# EAGLE design X16-ESC-Adapter (EAGLE 9.6.2)
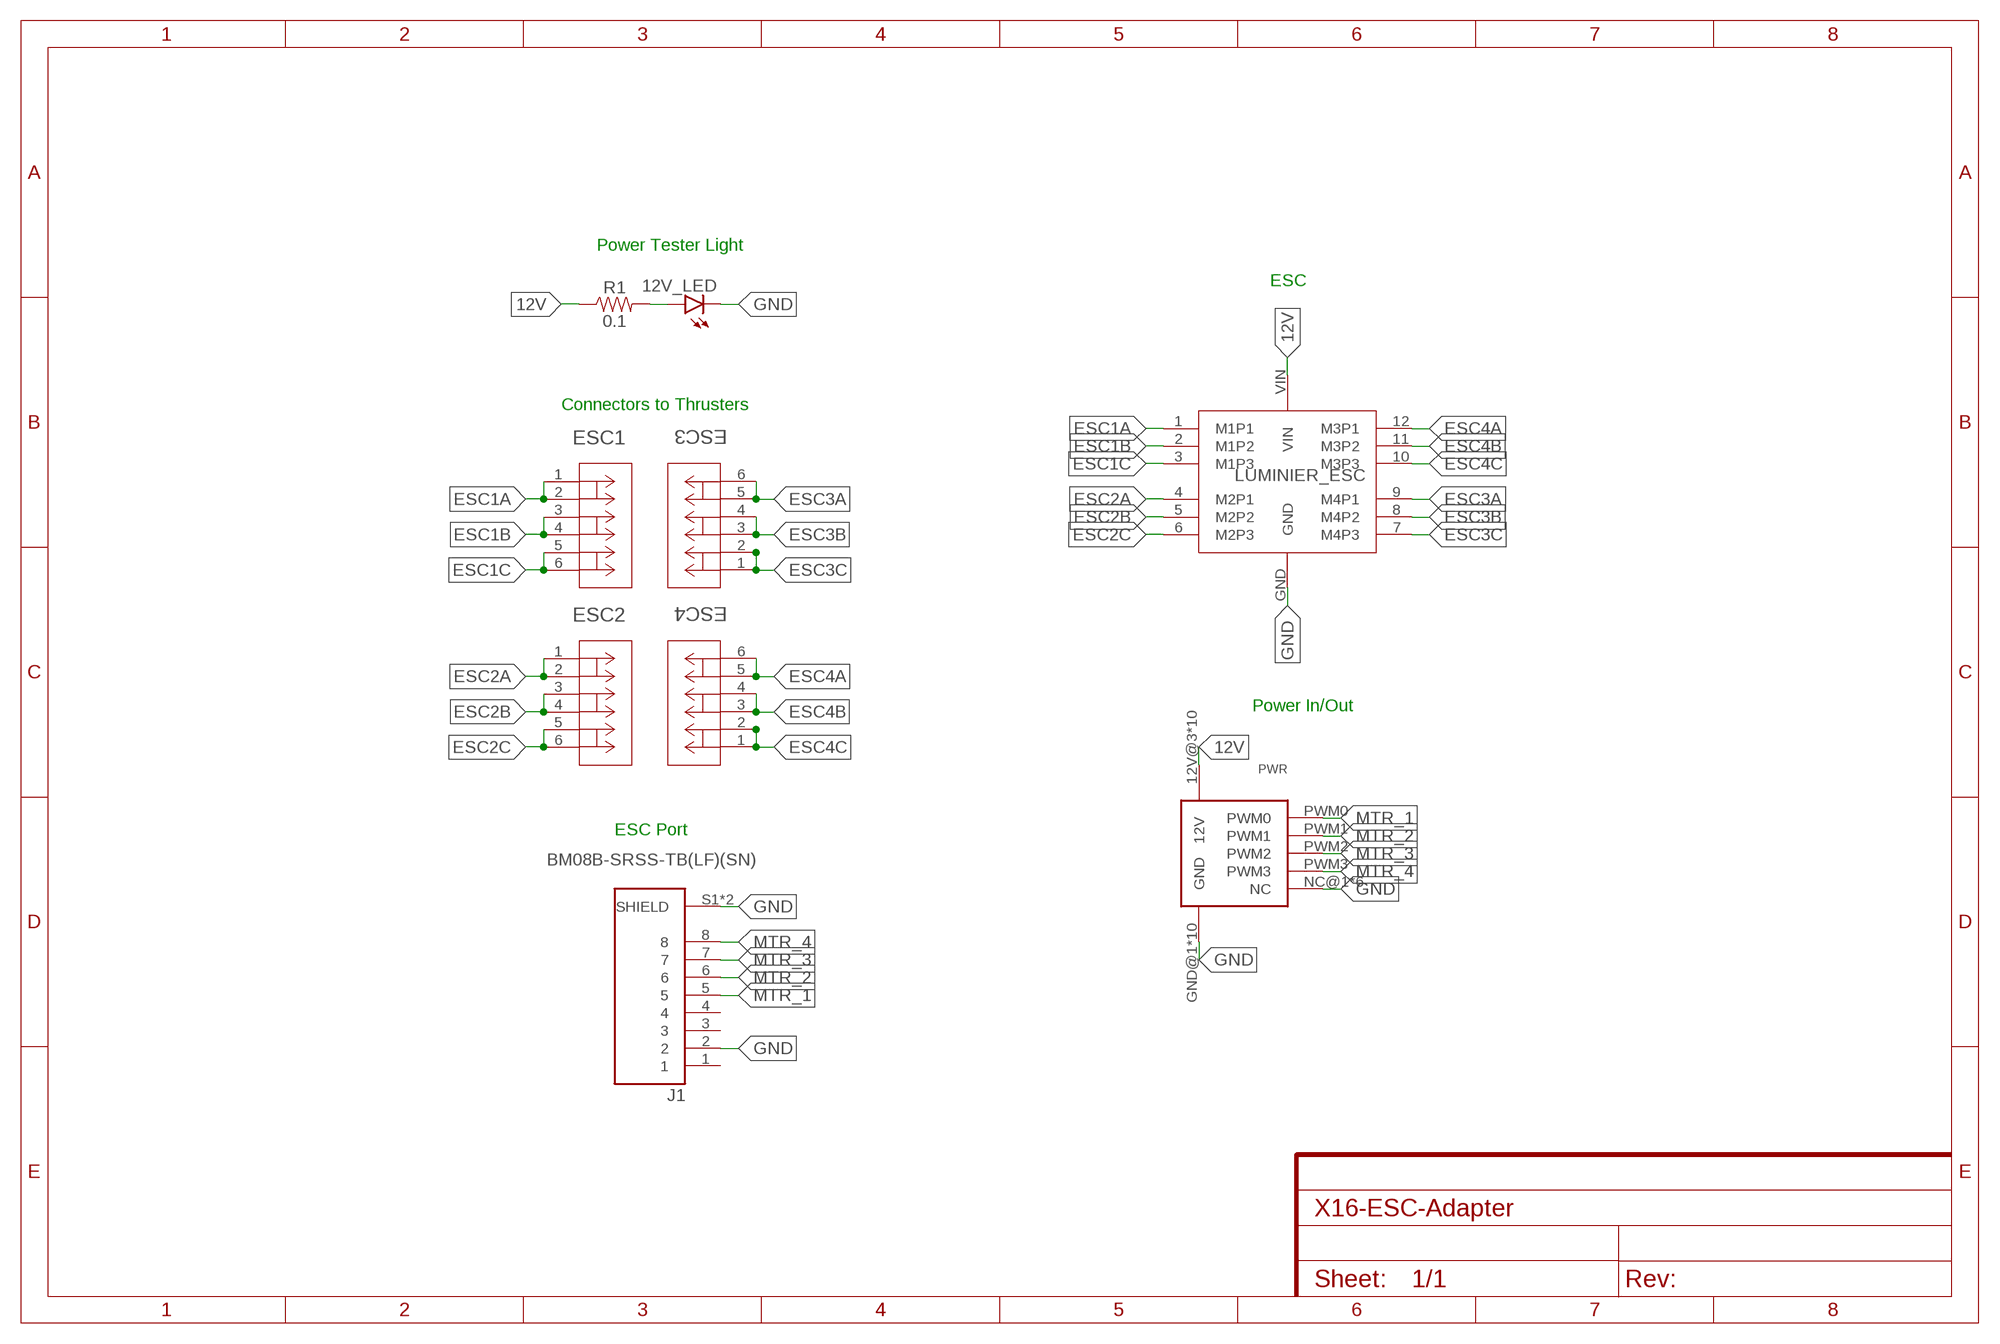
[diagram p0: schematic, sheet 1]

## Parts
12V_LED  LEDCHIPLED_0805  [CHIPLED_0805]
ESC1  CONN_1824750000  [CONN3_1824750000_WED]
ESC2  CONN_1824750000  [CONN3_1824750000_WED]
ESC3  CONN_1824750000  [CONN3_1824750000_WED]
ESC4  CONN_1824750000  [CONN3_1824750000_WED]
J1  BM08B-SRSS-TB(LF)(SN)  [JST_BM08B-SRSS-TB(LF)(SN)]
LUMINIER_ESC  LUMENIER  [LUMENIER]
PWR  CONN_BACKPLANE_ESC_ADAPTER  [CONN_BACKPLANE_ESC_ADAPTER]
R1  0.1  0.1OHM-0603-1/3W-1%  [0603]

## Nets
12V: LUMINIER_ESC.VIN PWR.12V@3(12V) PWR.12V@4(12V) PWR.12V@5(12V) PWR.12V@6(12V) PWR.12V@7(12V) PWR.12V@8(12V) PWR.12V@9(12V) PWR.12V@10(12V) PWR.12V@11(12V) PWR.12V@12(12V) R1.1
ESC1A: ESC1.1 ESC1.2 LUMINIER_ESC.1(M1P1)
ESC1B: ESC1.3 ESC1.4 LUMINIER_ESC.2(M1P2)
ESC1C: ESC1.5 ESC1.6 LUMINIER_ESC.3(M1P3)
ESC2A: ESC2.1 ESC2.2 LUMINIER_ESC.4(M2P1)
ESC2B: ESC2.3 ESC2.4 LUMINIER_ESC.5(M2P2)
ESC2C: ESC2.5 ESC2.6 LUMINIER_ESC.6(M2P3)
ESC3A: ESC3.5 ESC3.6 LUMINIER_ESC.9(M4P1)
ESC3B: ESC3.3 ESC3.4 LUMINIER_ESC.8(M4P2)
ESC3C: ESC3.1 ESC3.2 LUMINIER_ESC.7(M4P3)
ESC4A: ESC4.5 ESC4.6 LUMINIER_ESC.12(M3P1)
ESC4B: ESC4.3 ESC4.4 LUMINIER_ESC.11(M3P2)
ESC4C: ESC4.1 ESC4.2 LUMINIER_ESC.10(M3P3)
GND: 12V_LED.C J1.2 J1.S1(SHIELD) J1.S2(SHIELD) LUMINIER_ESC.GND PWR.GND@1(GND) PWR.GND@2(GND) PWR.GND@3(GND) PWR.GND@4(GND) PWR.GND@5(GND) PWR.GND@6(GND) PWR.GND@7(GND) PWR.GND@8(GND) PWR.GND@9(GND) PWR.GND@10(GND) PWR.NC@1(NC) PWR.NC@2(NC) PWR.NC@3(NC) PWR.NC@4(NC) PWR.NC@5(NC) PWR.NC@6(NC)
MTR_1: J1.5 PWR.PWM0
MTR_2: J1.6 PWR.PWM1
MTR_3: J1.7 PWR.PWM2
MTR_4: J1.8 PWR.PWM3
N$1: 12V_LED.A R1.2
Unconnected: J1.1 J1.3 J1.4

## Notes on the sheet
- Power Tester Light
- ESC
- Connectors to Thrusters
- Power In/Out
- ESC Port

## Library data of the parts
12V_LED = led:LED: LED OSRAM: - CHIPLED LG R971, LG N971, LY N971, LG Q971, LY Q971, LO R971, LY R971 LH N974, LH R974 LS Q976, LO Q976, LY Q976 LO Q996 - Hyper CHIPLED LW Q18S LB Q993, LB Q99A, LB R99A - SideLED LS A670, LO A670, LY A670, LG A670, LP A670 LB A673, LV A673, LT A673, LW A673 LH A674 LY A675 LS A676, LA A676, LO A676, LY A676, LW A676 LS A679, LY A679, LG A679 - Hyper Micro SIDELED® LS Y876, LA Y876, LO Y876, LY Y876 LT Y87S - SmartLED LW L88C, LW L88S LB L89C, LB L89S, LG L890 LS L89K, LO L89K, LY L89K LS L896, LA L896, LO L896, LY L896 - TOPLED LS T670, LO T670, LY T670, LG T670, LP T670 LSG T670, LSP T670, LSY T670, LOP T670, LYG T670 LG T671, LOG T671, LSG T671 LB T673, LV T673, LT T673, LW T673 LH T674 LS T676, LA T676, LO T676, LY T676, LB T676, LH T676, LSB T676, LW T676 LB T67C, LV T67C, LT T67C, LS T67K, LO T67K, LY T67K, LW E67C LS E67B, LA E67B, LO E67B, LY E67B, LB E67C, LV E67C, LT E67C LW T67C LS T679, LY T679, LG T679 LS T770, LO T770, LY T770, LG T770, LP T770 LB T773, LV T773, LT T773, LW T773 LH T774 LS E675, LA E675, LY E675, LS T675 LS T776, LA T776, LO T776, LY T776, LB T776 LHGB T686 LT T68C, LB T68C - Hyper Mini TOPLED® LB M676 - Mini TOPLED Santana® LG M470 LS M47K, LO M47K, LY M47K Source: http://www.osram.convergy.de LUXEON: - LUMILED® LXK2-PW12-R00, LXK2-PW12-S00, LXK2-PW14-U00, LXK2-PW14-V00 LXK2-PM12-R00, LXK2-PM12-S00, LXK2-PM14-U00 LXK2-PE12-Q00, LXK2-PE12-R00, LXK2-PE12-S00, LXK2-PE14-T00, LXK2-PE14-U00 LXK2-PB12-K00, LXK2-PB12-L00, LXK2-PB12-M00, LXK2-PB14-N00, LXK2-PB14-P00, LXK2-PB14-Q00 LXK2-PR12-L00, LXK2-PR12-M00, LXK2-PR14-Q00, LXK2-PR14-R00 LXK2-PD12-Q00, LXK2-PD12-R00, LXK2-PD12-S00 LXK2-PH12-R00, LXK2-PH12-S00 LXK2-PL12-P00, LXK2-PL12-Q00, LXK2-PL12-R00 Source: www.luxeon.com KINGBRIGHT: KA-3528ASYC Source: www.kingbright.com
ESC1-ESC4 = X16-ESC-Adapter:CONN_1824750000: ESC Adapter to Thruster; COPYRIGHT: Copyright (C) 2023 Ultra Librarian. All rights reserved.; DIGIKEY_PART_NUMBER_1: 281-2111-ND; MANUFACTURER_PART_NUMBER: 1824750000; MFR_NAME: Weidmuller
J1 = X16-ESC-Adapter:BM08B-SRSS-TB(LF)(SN); MANUFACTURER: JST Sales America Inc.; MAXIMUM_PACKAGE_HEIGHT: 6.3 mm; PARTREV: N/A; SNAPEDA_PN: BM08B-SRSS-TB(LF)(SN); STANDARD: Manufacturer Recommendations
LUMINIER_ESC = X16-ESC-Adapter:LUMENIER
PWR = X16-NewESCAdapterConn:CONN_BACKPLANE_ESC_ADAPTER: ESC Adapter to Backplane
R1 = SparkFun-Resistors:0.1OHM: 0.1Ω resistor A resistor is a passive two-terminal electrical component that implements electrical resistance as a circuit element. Resistors act to reduce current flow, and, at the same time, act to lower voltage levels within circuits. - Wikipedia; PROD_ID: RES-15715

## Board
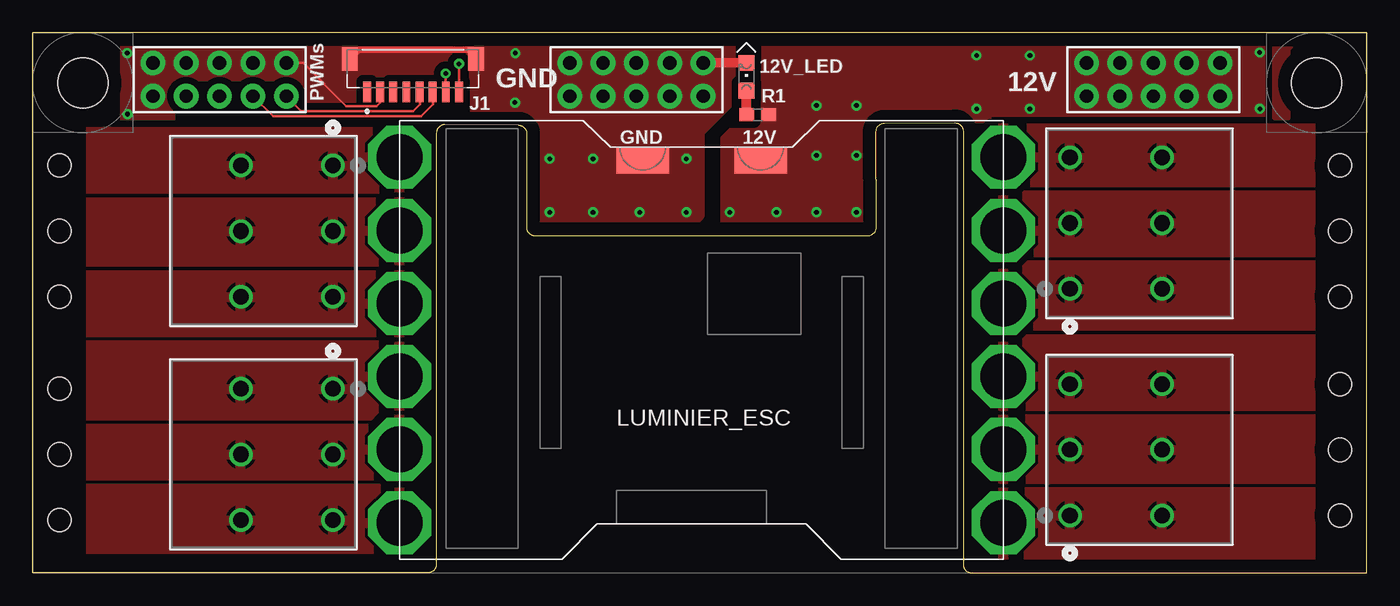
[diagram p1: board, top side]
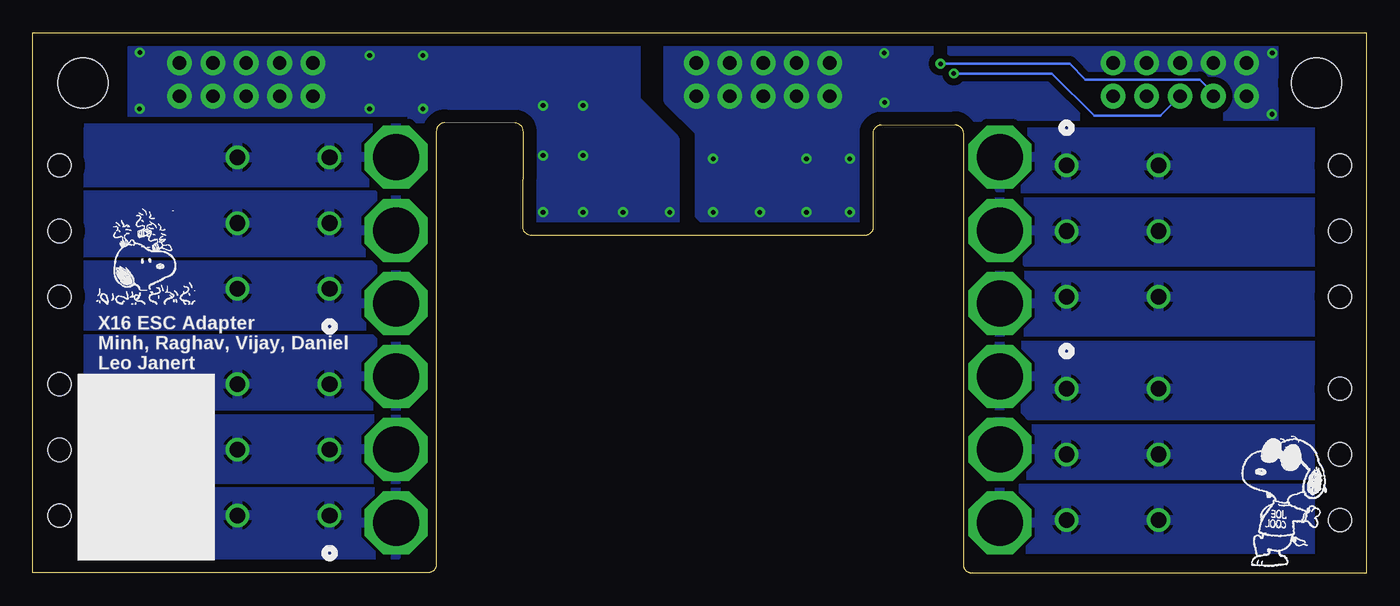
[diagram p2: board, bottom side, seen from below]

Size 101.6 x 41.15 mm. Coordinates in mm from the lower left corner, seen from the top.
Outline: 30.73,33.51 30.73,0.64 arc-90 30.1,0 0,0 0,41.15 101.6,41.15 101.6,0 71.5,0 arc-90 70.87,0.64 70.87,33.66 arc90 70.23,34.29 64.87,34.27 arc90 64.24,33.63 64.26,26.34 arc-90 63.62,25.7 38.23,25.7 arc-90 37.59,26.34 37.62,33.27 37.62,33.48 arc90 36.99,34.11 31.37,34.14 arc90 30.73,33.51
Copper layers (1*16): Top 0.035mm / dielectric 1.5mm / Bottom 0.035mm
Design rules "477": minimum track width 6mil, minimum drill 0.35mm, track to track 6mil, track to pad 6mil, pad to pad 6mil, via to via 6mil, smd to smd 6mil, copper to edge 40mil, drill to drill 6mil, minimum pad ring 10mil, minimum via ring 8mil, stop-mask expansion 4mil, vias tented up to drill 0mil, thermal gap 10mil
Holes 1.78 mm at 2.03,31.04 2.03,26.04 2.03,21.04 2.03,14.02 2.03,9.02 2.03,4.02 99.57,31.04 99.57,26.04 99.57,21.04 99.57,14.37 99.57,9.37 99.57,4.37

### Footprints (pad centres in the part's own frame; a part is rotated, then mirrored left to right if it is on the bottom)
CHIPLED_0805 = smd 1.2 x 1.2: A 0,-1.05; C 0,1.05
CONN3_1824750000_WED = drill 1.194 pad 1.702: 1 0,0; 2 0,-7.01; 3 5.004,0; 4 5.004,-7.01; 5 10.008,0; 6 10.008,-7.01
JST_BM08B-SRSS-TB(LF)(SN) = smd 0.6 x 1.55: 1 -3.5,-2.525; 2 -2.5,-2.525; 3 -1.5,-2.525; 4 -0.5,-2.525; 5 0.5,-2.525; 6 1.5,-2.525; 7 2.5,-2.525; 8 3.5,-2.525 | smd 1.2 x 1.8: S1 -4.8,0; S2 4.8,0
LUMENIER = drill 3.5 pad 4.8 octagon: 1 0,30.62; 2 0,25.05; 3 0,19.48; 4 0,13.92; 5 0,8.35; 6 0,2.78; 7 46,2.78; 8 46,8.35; 9 46,13.92; 10 46,19.48; 11 46,25.05; 12 46,30.62 | smd 4 x 2: GND 18.51,30.37; VIN 27.49,30.37
CONN_BACKPLANE_ESC_ADAPTER = drill 1.016 pad 1.88: 12V@3 90.424,36.322; 12V@4 90.424,38.862; 12V@5 87.884,36.322; 12V@6 87.884,38.862; 12V@7 85.344,36.322; 12V@8 85.344,38.862; 12V@9 82.804,36.322; 12V@10 82.804,38.862; 12V@11 80.264,36.322; 12V@12 80.264,38.862; GND@1 51.054,38.862; GND@2 51.054,36.322; GND@3 48.514,38.862; GND@4 48.514,36.322; GND@5 45.974,38.862; GND@6 45.974,36.322; GND@7 43.434,38.862; GND@8 43.434,36.322; GND@9 40.894,38.862; GND@10 40.894,36.322; NC@1 19.304,38.862; NC@2 16.764,38.862; NC@3 14.224,38.862; NC@4 11.684,38.862; NC@5 9.144,38.862; NC@6 9.144,36.322; PWM0 19.304,36.322; PWM1 16.764,36.322; PWM2 14.224,36.322; PWM3 11.684,36.322
0603 = smd 1.1 x 1: 1 -0.85,0; 2 0.85,0
6-32-HOLE = hole 3.81: 0,0

### Placement (x,y rotation side)
12V_LED  54.36,37.8 0 top
ESC1  22.86,31.04 270 top
ESC2  22.86,14.02 270 top
ESC3  78.99,4.37 90 top
ESC4  78.99,21.64 90 top
J1  28.96,39.17 0 top
LUMINIER_ESC  27.94,1.04 0 top
PWR  0,0 0 top
R1  55.22,34.9 180 top
U$1  [6-32-HOLE]  3.81,37.34 0 top
U$2  [6-32-HOLE]  97.79,37.34 0 top

### Tracks (layer width: path | path; a pad name or v marks a point on that pad's centre or on a via)
12V  (via drill 0.35)
  other vias: 53.09,27.48 56.64,27.48 59.69,27.48 62.74,27.48 62.74,31.8 62.74,35.61 59.69,35.61 59.69,31.8 71.88,35.36 71.88,39.42 75.95,39.42 75.95,35.36 93.45,39.65 93.47,35.36
  pour Top (isolate 0.508, rank 6, no thermals): 55.73,36.04 52.73,33.05 52.73,25.48 101.63,25.48 102.62,26.47 102.62,41.2 101.85,41.96 55.73,41.96
  pour Bottom (isolate 0.508, rank 6, no thermals): 55.7,36.04 52.73,33.07 52.73,25.5 101.9,25.5 102.62,26.21 102.62,41.2 101.85,41.96 55.7,41.96
  cutout Top: 97.79,34.01 101.57,34.01 101.57,-0.03 97.79,-0.03
ESC1A
  pour Top (isolate 0.508): 1.52,29.26 28.45,29.26 29.21,30.02 29.21,33.58 1.52,33.58
  pour Bottom (isolate 0.508): 1.52,33.58 1.52,29.26 27.94,29.26 29.72,31.04 29.72,32.82 28.96,33.58
ESC1B
  pour Top (isolate 0.508): 1.52,28.24 30.23,28.24 30.23,24.18 29.72,23.67 1.52,23.67
  pour Bottom (isolate 0.508): 28.96,28.24 1.52,28.24 1.52,23.67 25.91,23.67 26.42,24.18 28.96,24.18 29.97,25.2 29.97,27.23
ESC1C
  pour Top (isolate 0.508): 1.52,22.66 1.52,18.34 28.96,18.34 30.23,19.61 30.23,21.39 29.97,21.64 29.97,22.66
  pour Bottom (isolate 0.508): 28.96,22.66 1.52,22.66 1.52,18.34 28.7,18.34 29.97,19.61 29.97,21.64
ESC2A
  pour Top (isolate 0.508): 28.7,17.32 1.52,17.32 1.52,11.99 25.65,11.99 26.42,12.75 28.19,12.75 29.72,14.27 29.72,16.31
  pour Bottom (isolate 0.508): 28.7,17.32 1.52,17.32 1.52,11.99 25.65,11.99 26.42,12.75 28.7,12.75 29.97,14.02 29.97,16.05
ESC2B
  pour Top (isolate 0.508): 1.52,10.97 1.52,7.42 28.7,7.42 29.97,8.69 29.97,10.72 28.96,11.73 27.18,11.73 26.42,10.97
  pour Bottom (isolate 0.508): 26.42,10.97 1.52,10.97 1.52,7.42 28.7,7.42 29.97,8.69 29.97,10.46 28.96,11.48 26.92,11.48
ESC2C
  pour Top (isolate 0.508): 1.52,6.4 1.52,1.83 28.7,1.83 29.97,3.1 29.97,4.88 28.45,6.4
  pour Bottom (isolate 0.508): 1.52,6.4 28.7,6.4 29.97,5.13 29.97,3.35 28.45,1.83 1.52,1.83
ESC3A
  pour Top (isolate 0.508): 72.14,16.56 72.14,14.27 73.71,12.7 100.08,12.7 100.08,17.78 73.36,17.78
  pour Bottom (isolate 0.508): 73.41,17.78 100.08,17.78 100.08,12.75 73.41,12.75 72.14,14.02 72.14,16.51
ESC3B
  pour Top (isolate 0.508): 73.1,11.68 71.88,10.46 71.88,8.69 72.9,7.67 73.15,7.67 73.66,7.16 99.82,7.16 99.82,11.68
  pour Bottom (isolate 0.508): 73.1,11.68 99.82,11.68 99.82,7.16 73.66,7.16 71.88,8.94 71.88,10.46
ESC3C
  pour Top (isolate 0.508): 99.82,6.15 73.15,6.15 71.88,4.88 71.88,3.1 73.66,1.32 99.82,1.32
  pour Bottom (isolate 0.508): 73.15,6.15 99.82,6.15 99.82,1.32 73.91,1.32 71.88,3.35 71.88,4.88
ESC4A
  pour Top (isolate 0.508): 100.08,33.83 72.39,33.83 71.88,33.32 71.88,31.04 73.15,29.77 100.08,29.77
  pour Bottom (isolate 0.508): 73.15,33.83 100.08,33.83 100.08,29.77 73.15,29.77 71.88,31.04 71.88,32.56
ESC4B
  pour Top (isolate 0.508): 73.41,28.75 71.88,27.23 71.88,25.45 72.9,24.43 100.08,24.43 100.08,28.75
  pour Bottom (isolate 0.508): 100.08,28.75 100.08,24.43 73.15,24.43 72.14,25.45 71.88,25.45 71.88,26.97 73.66,28.75
ESC4C
  pour Top (isolate 0.508): 73.91,23.42 71.88,21.39 71.88,19.86 72.9,18.85 100.08,18.85 100.08,23.42
  pour Bottom (isolate 0.508): 100.08,23.42 100.08,18.85 73.15,18.85 72.14,19.86 72.14,21.64 73.15,22.66 74.68,22.66 75.44,23.42
GND  (via drill 0.35)
  Top 0.203: PWR.NC@1 20.59,38.86 23.88,35.57 26.2,35.57 26.46,35.83 J1.2
  Top 0.508: J1.S2 33.76,39.57 33.45,39.88 24.87,39.88 J1.S1
  Top 0.762: 12V_LED.C PWR.GND@1
  other vias: 7.19,39.6 7.21,34.95 36.75,39.6 36.73,35.84 39.37,31.55 42.67,31.55 39.37,27.48 42.67,27.48 46.23,27.48 49.78,27.48 49.78,31.55
  pour Top (isolate 0.508, rank 6, no thermals): 53.16,42.21 0.51,42.21 -1.02,40.69 -1.02,27.23 0.25,25.96 49.53,25.96 50.8,27.23 50.8,33.58 53.16,35.94
  pour Bottom (isolate 0.508, rank 6, no thermals): 0.51,42.21 -1.02,40.69 -1.02,27.23 0.25,25.96 49.53,25.96 50.8,27.23 50.8,33.58 53.16,35.94 53.16,42.21
  cutout Bottom: 0.25,33.63 3.78,33.63 3.86,33.55 3.86,0.05 0.08,0.05 0.08,33.48 0.15,33.55
  cutout Top: 0.18,33.68 3.96,33.68 3.96,0.05 0.18,0.05
  cutout Bottom: 6.55,40.69 5.77,40.69 5.77,34.21 5.61,34.06 6.6,34.06 6.6,40.64
  cutout Top: 5.77,40.67 6.55,40.67 6.55,34.04 5.66,34.04 5.64,34.06 5.77,34.19
  pour Top: 96.04,40.18 94.49,40.18 94.46,40.16 94.46,34.65 94.54,34.57 95.68,34.57 95.73,34.62 95.73,39.88
  cutout Bottom: 94.4,40.18 96.01,40.18 96.04,40.16 95.71,39.83 95.71,34.59 94.46,34.59 94.46,40.12
GND1
  cutout Bottom: 97.79,33.99 101.57,33.99 101.57,-0.03 97.79,-0.03
MTR_1
  Top 0.203: J1.5 29.49,36.61 29.49,35.71 28.96,35.18 20.45,35.18 PWR.PWM0
MTR_2
  Top 0.203: J1.6 30.49,36.61 30.49,35.71 29.57,34.8 18.29,34.8 PWR.PWM1
MTR_3  (via drill 0.35)
  Top 0.203: J1.7 31.46,38.04 v31.45,38.05
  Bottom 0.203: PWR.PWM2 15.72,34.82 20.75,34.82 23.98,38.05 v31.45,38.05
MTR_4  (via drill 0.35)
  Top 0.203: v32.46,38.79 J1.8
  Bottom 0.203: v32.46,38.79 22.62,38.79 21.42,37.59 12.7,37.59 11.68,36.58 PWR.PWM3
N$1
  Top 0.762: R1.2 54.36,35.16 12V_LED.A

### Text on the board
tPlace: GND | 12V | PWMs | GND | 12V
bPlace: X16 ESC Adapter / Minh, Raghav, Vijay, Daniel / Leo Janert
tOrigins: C:/Users/leoja/Downloads/snoopy and woodstock.bmp | C:/Users/leoja/Downloads/snoopy and woodstock.bmp
tNames: C:/Users/leoja/Downloads/snoopy bmp.bmp